# Altium schematic sheet SMT2.SchDoc
size A1
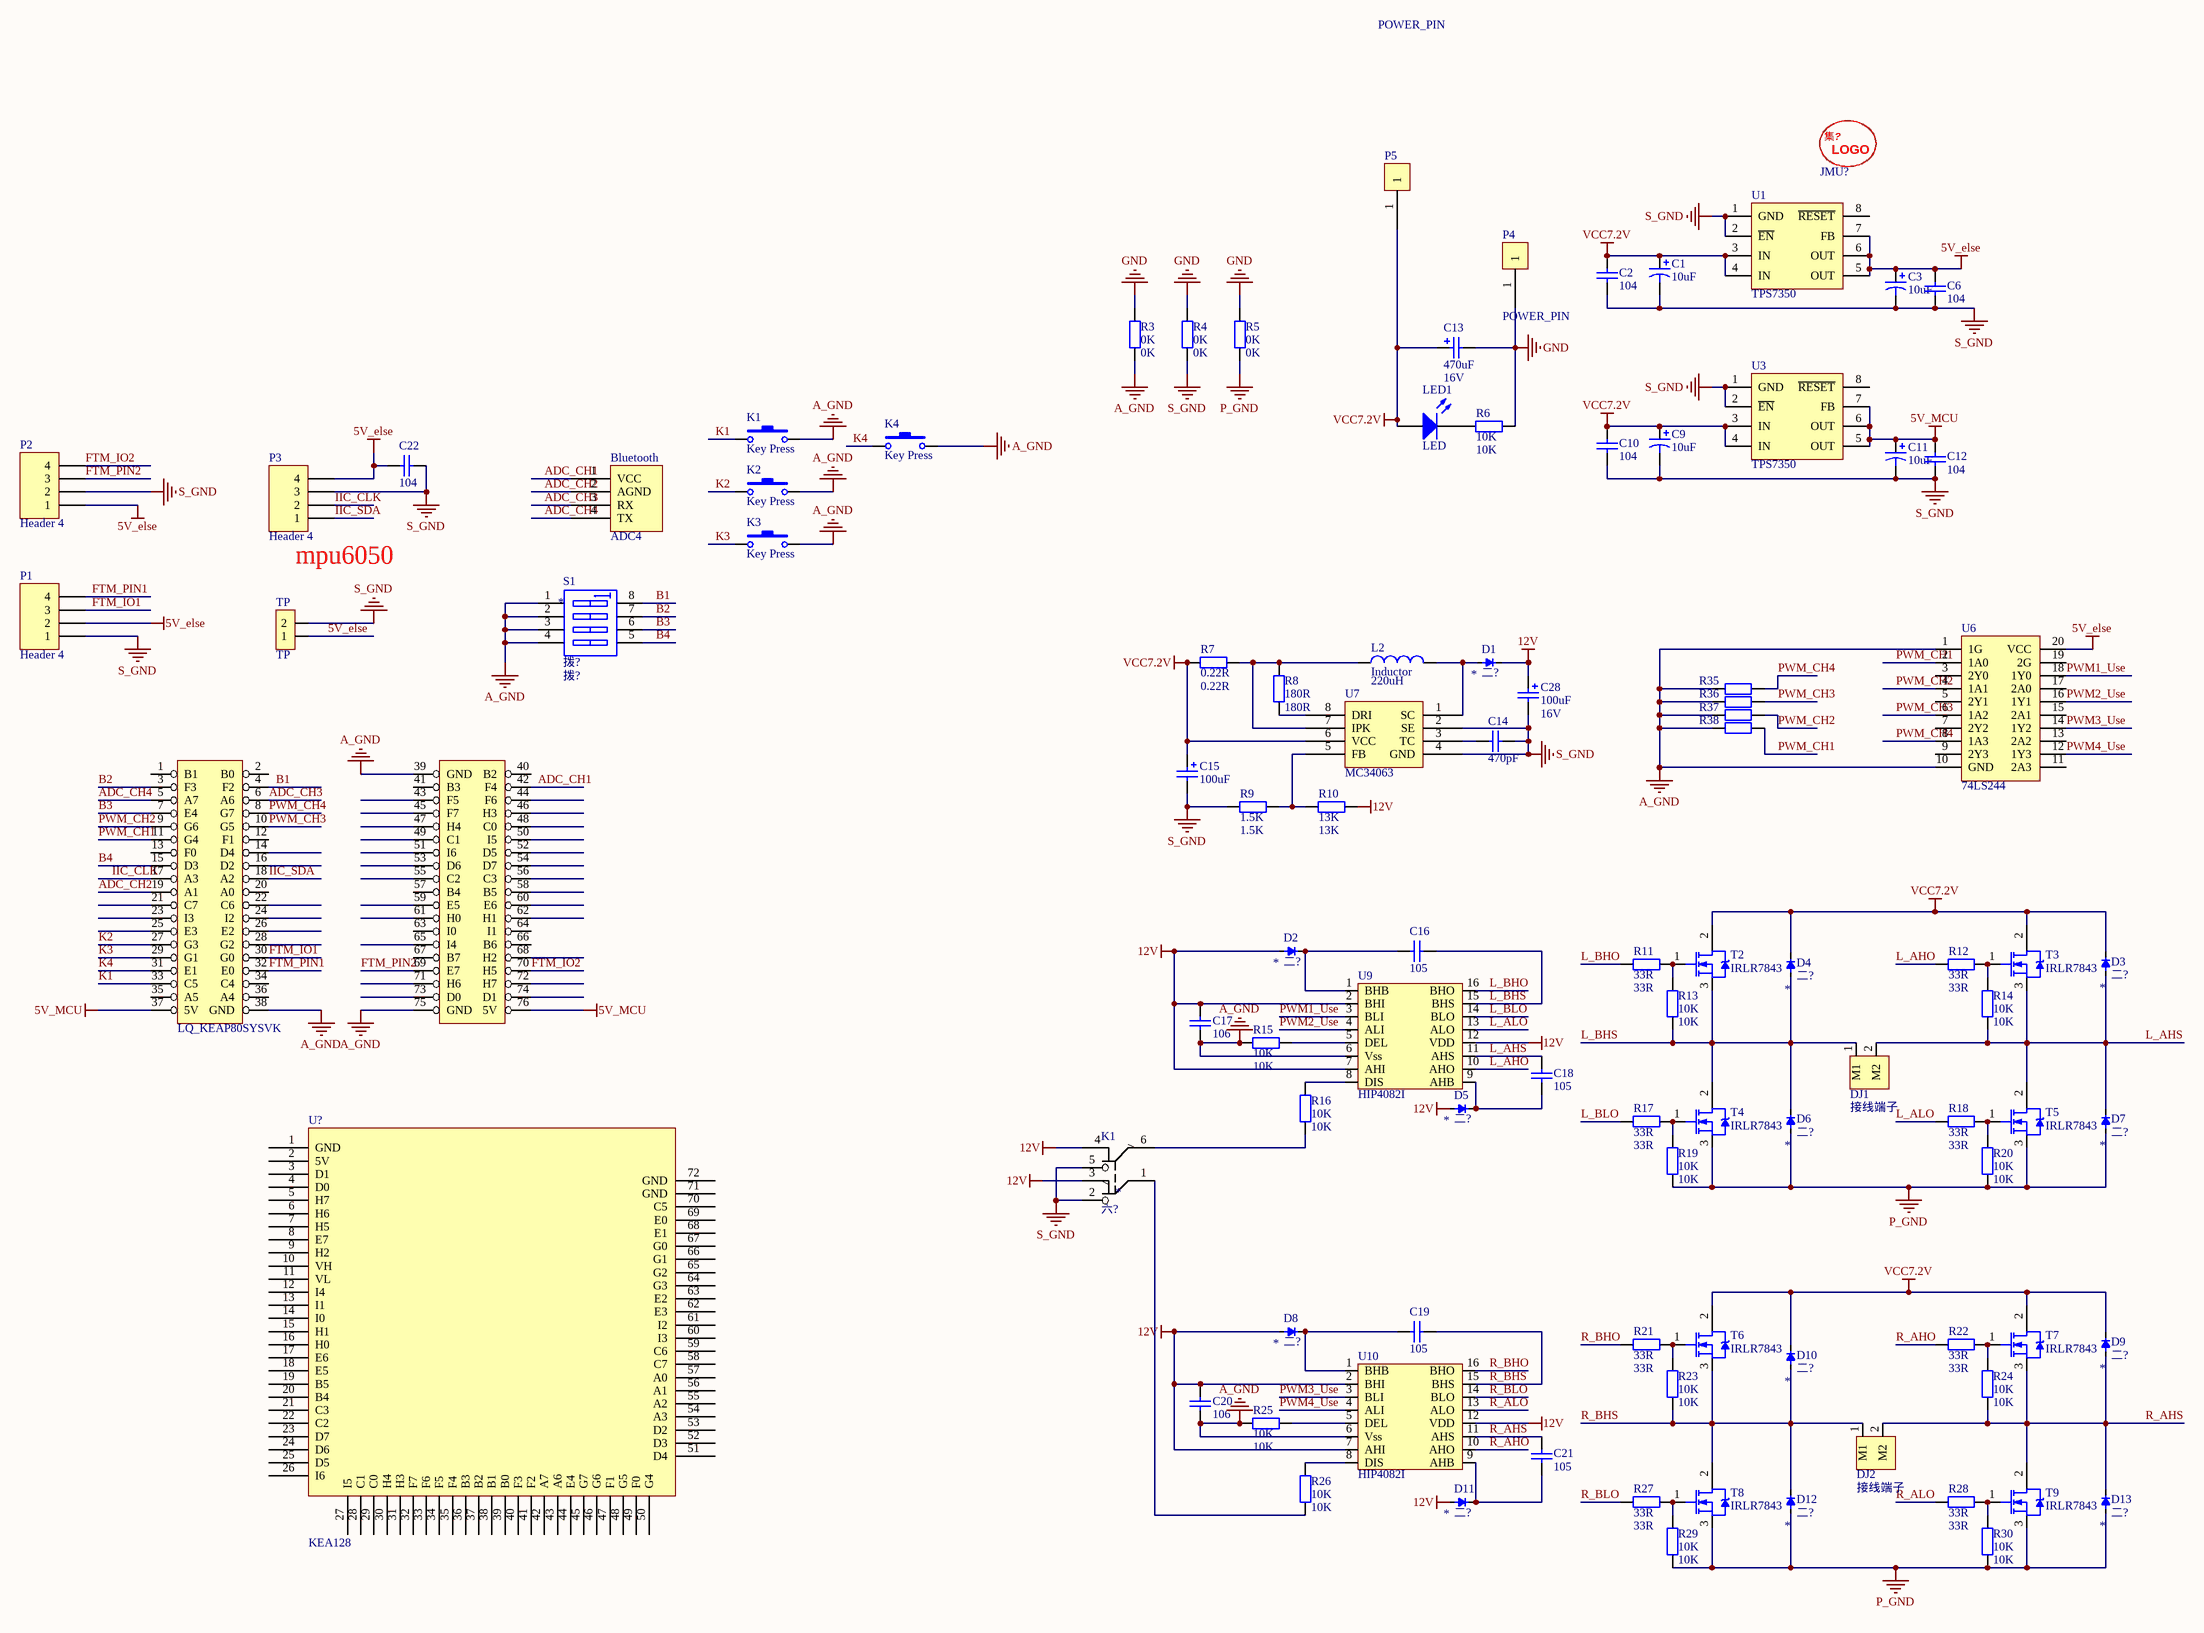
[diagram p0: SMT2.SchDoc]

## Parts
(Parts that share a designator on the sheet are numbered #1, #2 ... from top to bottom, then left to right.)
ADC4  ADC4  [S0P4]  (value not drawn)
C1  value 10uF  [pol cap(10uF)]  (hidden comment: pol cap)
C2  104  [0805-0C]
C3  value 10uF  [pol cap(10uF)]  (hidden comment: pol cap)
C6  104  [0805-0C]
C9  value 10uF  [pol cap(10uF)]  (hidden comment: pol cap)
C10  104  [0805-0C]
C11  value 10uF  [pol cap(10uF)]  (hidden comment: pol cap)
C12  104  [0805-0C]
C13  value 470uF  Voltage: 16V  [ED8]  (hidden comment: Cap Pol SMT G)
C14  value 470pF  [0805-0C]  (hidden comment: Cap Semi)
C15  value 100uF  [胆电容 - duplicate]  (hidden comment: Cap Pol1)
C16  105  [0805-0C]
C17  106  [0805-0C]
C18  105  [0805-0C]
C19  105  [0805-0C]
C20  106  [0805-0C]
C21  105  [0805-0C]
C22  104  [0805-0C]
C28  value 100uF  Voltage: 16V  [ED6.3]  (hidden comment: Cap Pol SMT G)
D1  *  [二极管]
D2  *  [二极管]
D3  *  [二极管]
D4  *  [二极管]
D5  *  [二极管]
D6  *  [二极管]
D7  *  [二极管]
D8  *  [二极管]
D9  *  [二极管]
D10  *  [二极管]
D11  *  [二极管]
D12  *  [二极管]
D13  *  [二极管]
DJ1  接线端子  [接线端子]
DJ2  接线端子  [接线端子]
JMU?  LOGO(JMU)  [JMU_logo]  (value not drawn)
K1#1  Key Press  [K_Press]
K1#2  *  [六脚开关]
K2  Key Press  [K_Press]
K3  Key Press  [K_Press]
K4  Key Press  [K_Press]
L2  Inductor  value 220uH  [电感（220uh）]
LED1  LED  [LED(0805)]
P1  Header 4  [WAFER4]
P2  Header 4  [WAFER4]
P3  Header 4  [WAFER4]
P4  POWER_PIN  [POWER_PIN]
P5  POWER_PIN  [POWER_PIN]
Q_KEAP80SYSVK  LQ_KEAP80SYSVK  [LQ_KEAP80SYSVK]
R3  0K  [0603]
R4  0K  [0603]
R5  0K  [0805]
R6  10K  [0603]
R7  0.22R  [0805]
R8  180R  [0805]
R9  1.5K  [0805]
R10  13K  [0805]
R11  33R  [0603]
R12  33R  [0603]
R13  10K  [0603]
R14  10K  [0603]
R15  10K  [0603]
R16  10K  [0603]
R17  33R  [0603]
R18  33R  [0603]
R19  10K  [0603]
R20  10K  [0603]
R21  33R  [0603]
R22  33R  [0603]
R23  10K  [0603]
R24  10K  [0603]
R25  10K  [0603]
R26  10K  [0603]
R27  33R  [0603]
R28  33R  [0603]
R29  10K  [0603]
R30  10K  [0603]
R35  10K  [0603]  (value not drawn)
R36  10K  [0603]  (value not drawn)
R37  10K  [0603]  (value not drawn)
R38  10K  [0603]  (value not drawn)
S1  *  [Switch_4P]
T2  IRLR7843  [IRLR7843(MOS)]
T3  IRLR7843  [IRLR7843(MOS)]
T4  IRLR7843  [IRLR7843(MOS)]
T5  IRLR7843  [IRLR7843(MOS)]
T6  IRLR7843  [IRLR7843(MOS)]
T7  IRLR7843  [IRLR7843(MOS)]
T8  IRLR7843  [IRLR7843(MOS)]
T9  IRLR7843  [IRLR7843(MOS)]
TP  TP  [2P]
U1  TPS7350  [SOIC-8(TPS7333/50)]
U3  TPS7350  [SOIC-8(TPS7333/50)]
U6  74LS244  [74LS244D]
U7  MC34063  [MA34063]
U9  HIP4082I  [HIP4082I]
U10  HIP4082I  [HIP4082I]
U?  KEA128  [LQFP80]

## Nets
5V_else: C3.1 C6.1 C22.1 P1.2 P2.1 P3.4 TP.1 U1.5(OUT) U1.6(OUT) U1.7(FB) U6.20(VCC)
5V_MCU: C11.1 C12.1 Q_KEAP80SYSVK.37(5V) Q_KEAP80SYSVK.76(5V) U3.5(OUT) U3.6(OUT) U3.7(FB)
12V: C17.1 C20.1 C28.1 D1.2(-) D2.1(+) D5.1(+) D8.1(+) D11.1(+) K1#2.3 K1#2.4 R10.2 U9.2(BHI) U9.7(AHI) U9.12(VDD) U10.2(BHI) U10.7(AHI) U10.12(VDD)
A_GND: C17.2 C20.2 K1#1.2 K2.2 K3.2 K4.2 Q_KEAP80SYSVK.38(GND) Q_KEAP80SYSVK.39(GND) Q_KEAP80SYSVK.75(GND) R3.2 R15.1 R25.1 R35.1 R36.1 R37.1 R38.1 S1.1(A1) S1.2(A2) S1.3(A3) S1.4(A4) U6.1(1G) U6.10(GND) U9.6(Vss) U10.6(Vss)
GND: C13.2 P4.1 R3.1 R4.1 R5.1 R6.1
P_GND: D6.1(+) D7.1(+) D12.1(+) D13.1(+) R5.2 R19.1 R20.1 R29.1 R30.1 T4.3(S) T5.3(S) T8.3(S) T9.3(S)
S_GND: C1.2 C2.2 C3.2 C6.2 C9.2 C10.2 C11.2 C12.2 C14.1 C15.2 C22.2 C28.2 K1#2.2 K1#2.5 P1.1 P2.2 P3.3 R4.2 R9.1 TP.2 U1.1(GND) U1.2(~{EN}) U3.1(GND) U3.2(~{EN}) U7.2(SE) U7.4(GND)
VCC7.2V: C1.1 C2.1 C9.1 C10.1 C13.1 C15.1 D3.2(-) D4.2(-) D9.2(-) D10.2(-) LED1.1(A) P5.1 R7.1 T2.2(D) T3.2(D) T6.2(D) T7.2(D) U1.3(IN) U1.4(IN) U3.3(IN) U3.4(IN) U7.6(VCC)
ADC_CH1: ADC4.1(VCC) Q_KEAP80SYSVK.42(F4)
ADC_CH2: ADC4.2(AGND) Q_KEAP80SYSVK.19(A1)
ADC_CH3: ADC4.3(RX) Q_KEAP80SYSVK.6(A6)
ADC_CH4: ADC4.4(TX) Q_KEAP80SYSVK.5(A7)
B1: Q_KEAP80SYSVK.4(F2) S1.8(B1)
B2: Q_KEAP80SYSVK.3(F3) S1.7(B2)
B3: Q_KEAP80SYSVK.7(E4) S1.6(B3)
B4: Q_KEAP80SYSVK.15(D3) S1.5(B4)
FTM_IO1: P1.3 Q_KEAP80SYSVK.30(G0)
FTM_IO2: P2.4 Q_KEAP80SYSVK.70(H5)
FTM_PIN1: P1.4 Q_KEAP80SYSVK.32(E0)
FTM_PIN2: P2.3 Q_KEAP80SYSVK.69(E7)
IIC_CLK: P3.2 Q_KEAP80SYSVK.17(A3)
IIC_SDA: P3.1 Q_KEAP80SYSVK.18(A2)
K1: K1#1.1 Q_KEAP80SYSVK.33(C5)
K2: K2.1 Q_KEAP80SYSVK.27(G3)
K3: K3.1 Q_KEAP80SYSVK.29(G1)
K4: K4.1 Q_KEAP80SYSVK.31(E1)
L_AHO: R12.2 U9.10(AHO)
L_AHS: C18.2 D3.1(+) D7.2(-) DJ1.2(M2) R14.1 T3.3(S) T5.2(D) U9.11(AHS)
L_ALO: R18.2 U9.13(ALO)
L_BHO: R11.2 U9.16(BHO)
L_BHS: C16.1 D4.1(+) D6.2(-) DJ1.1(M1) R13.1 T2.3(S) T4.2(D) U9.15(BHS)
L_BLO: R17.2 U9.14(BLO)
PWM1_Use: U6.18(1Y0) U9.3(BLI)
PWM2_Use: U6.16(1Y1) U9.4(ALI)
PWM3_Use: U6.14(1Y2) U10.3(BLI)
PWM4_Use: U6.12(1Y3) U10.4(ALI)
PWM_CH1: Q_KEAP80SYSVK.11(G4) R38.2 U6.2(1A0)
PWM_CH2: Q_KEAP80SYSVK.9(G6) R37.2 U6.4(1A1)
PWM_CH3: Q_KEAP80SYSVK.10(G5) R36.2 U6.6(1A2)
PWM_CH4: Q_KEAP80SYSVK.8(G7) R35.2 U6.8(1A3)
R_AHO: R22.2 U10.10(AHO)
R_AHS: C21.2 D9.1(+) D13.2(-) DJ2.2(M2) R24.1 T7.3(S) T9.2(D) U10.11(AHS)
R_ALO: R28.2 U10.13(ALO)
R_BHO: R21.2 U10.16(BHO)
R_BHS: C19.1 D10.1(+) D12.2(-) DJ2.1(M1) R23.1 T6.3(S) T8.2(D) U10.15(BHS)
R_BLO: R27.2 U10.14(BLO)
NetC14_2: C14.2 U7.3(TC)
NetC16_2: C16.2 D2.2(-) U9.1(BHB)
NetC18_1: C18.1 D5.2(-) U9.9(AHB)
NetC19_2: C19.2 D8.2(-) U10.1(BHB)
NetC21_1: C21.1 D11.2(-) U10.9(AHB)
NetD1_1: D1.1(+) L2.2 U7.1(SC)
NetK1#2_1: K1#2.1 R26.1
NetK1#2_6: K1#2.6 R16.1
NetL2_1: L2.1 R7.2 R8.2 U7.7(IPK)
NetLED1_2: LED1.2(K) R6.2
NetR8_1: R8.1 U7.8(DRI)
NetR9_2: R9.2 R10.1 U7.5(FB)
NetR11_1: R11.1 R13.2 T2.1(G)
NetR12_1: R12.1 R14.2 T3.1(G)
NetR15_2: R15.2 U9.5(DEL)
NetR16_2: R16.2 U9.8(DIS)
NetR17_1: R17.1 R19.2 T4.1(G)
NetR18_1: R18.1 R20.2 T5.1(G)
NetR21_1: R21.1 R23.2 T6.1(G)
NetR22_1: R22.1 R24.2 T7.1(G)
NetR25_2: R25.2 U10.5(DEL)
NetR26_2: R26.2 U10.8(DIS)
NetR27_1: R27.1 R29.2 T8.1(G)
NetR28_1: R28.1 R30.2 T9.1(G)

Not connected (* = marked no-connect by the designer): Q_KEAP80SYSVK 1(B1) 2(B0) 12(F1) 13(F0) 14(D4) 16(D2) 20(A0) 21(C7) 22(C6) 23(I3) 24(I2) 25(E3) 26(E2) 28(G2) 34(C4) 35(A5) 36(A4) 40(B2) 41(B3) 43(F5) 44(F6) 45(F7) 46(H3) 47(H4) 48(C0) 49(C1) 50(I5) 51(I6) 52(D5) 53(D6) 54(D7) 55(C2) 56(C3) 57(B4) 58(B5) 59(E5) 60(E6) 61(H0) 62(H1) 63(I0) 64(I1) 65(I4) 66(B6) 67(B7) 68(H2) 71(H6) 72(H7) 73(D0) 74(D1); U1 8(~{RESET}); U3 8(~{RESET}); U6 3(2Y0) 5(2Y1) 7(2Y2) 9(2Y3) 11(2A3) 13(2A2) 15(2A1) 17(2A0) 19(2G); U? 1(GND) 2(5V) 3(D1) 4(D0) 5(H7) 6(H6) 7(H5) 8(E7) 9(H2) 10(VH) 11(VL) 12(I4) 13(I1) 14(I0) 15(H1) 16(H0) 17(E6) 18(E5) 19(B5) 20(B4) 21(C3) 22(C2) 23(D7) 24(D6) 25(D5) 26(I6) 27(I5) 28(C1) 29(C0) 30(H4) 31(H3) 32(F7) 33(F6) 34(F5) 35(F4) 36(B3) 37(B2) 38(B1) 39(B0) 40(F3) 41(F2) 42(A7) 43(A6) 44(E4) 45(G7) 46(G6) 47(F1) 48(G5) 49(F0) 50(G4) 51(D4) 52(D3) 53(D2) 54(A3) 55(A2) 56(A1) 57(A0) 58(C7) 59(C6) 60(I3) 61(I2) 62(E3) 63(E2) 64(G3) 65(G2) 66(G1) 67(G0) 68(E1) 69(E0) 70(C5) 71(GND) 72(GND)

## Notes on the sheet
- (near P3) mpu6050
- (in symbol JMU-LOGO) 集?; LOGO
- (in symbol LQ_KEAP80SYSVK) http://longqiu.taobao.com/
- (in symbol 二极管) 二?
- (in symbol 六脚开关) 六?
- (in symbol 拨码开关(4位)(贴片)) 拨?

## Library data of the parts
ADC4 = Bluetooth
C1 C3 C9 C11 = pol cap: 通用有极电容
C2 C6 C10 C12 C16-C22 = CAP
C13 C28 = Cap Pol SMT G: Polarized Capacitor (Radial); Published: 8-Jun-2000; Revision: July-2002: Re-released for DXP Platform.; Publisher: Altium Limited
C14 = Cap Semi: Capacitor (Semiconductor SIM Model); Published: 8-Jun-2000; LatestRevisionDate: 29-May-2009; LatestRevisionNote: IPC-7351 Footprint Added.; PackageReference: C1206; Publisher: Altium Limited; PackageDescription: Chip Capacitor
C15 = Cap Pol1: Polarized Capacitor (Radial); Published: 8-Jun-2000; LatestRevisionDate: 17-Jul-2002; LatestRevisionNote: Re-released for DXP Platform.; PackageReference: RB7.6-15; Publisher: Altium Limited; PackageDescription: Polarized Capacitor (Radial); 2 Leads
D1-D13 = 二极管
JMU? = JMU-LOGO
K1#1 K2-K4 = K_Press: 贴片按键
K1#2 = 六脚开关
LED1 = LED: 发光二极管
P1-P3 = Header : Header, 4-Pin; LatestRevisionDate: 17-Jul-2002; LatestRevisionNote: Re-released for DXP Platform.; Publisher: Altium Limited
R3-R30 R35-R38 = Res: 通用电阻
  R3-R5: Value: 0K
  R6 R13-R16 R19 R20 R23-R26 R29 R30 R35-R38: Value: 10K
  R7: Value: 0.22R
  R8: Value: 180R
  R9: Value: 1.5K
  R10: Value: 13K
  R11 R12 R17 R18 R21 R22 R27 R28: Value: 33R
S1 = 拨码开关(4位)(贴片): 拨码开关（4位）
T2-T9 = N_MOS(IR
TP = 2P
U1 U3 = TPS7350: 稳压元件（5V）
U? = KE